# Altium project Template.PrjPCB
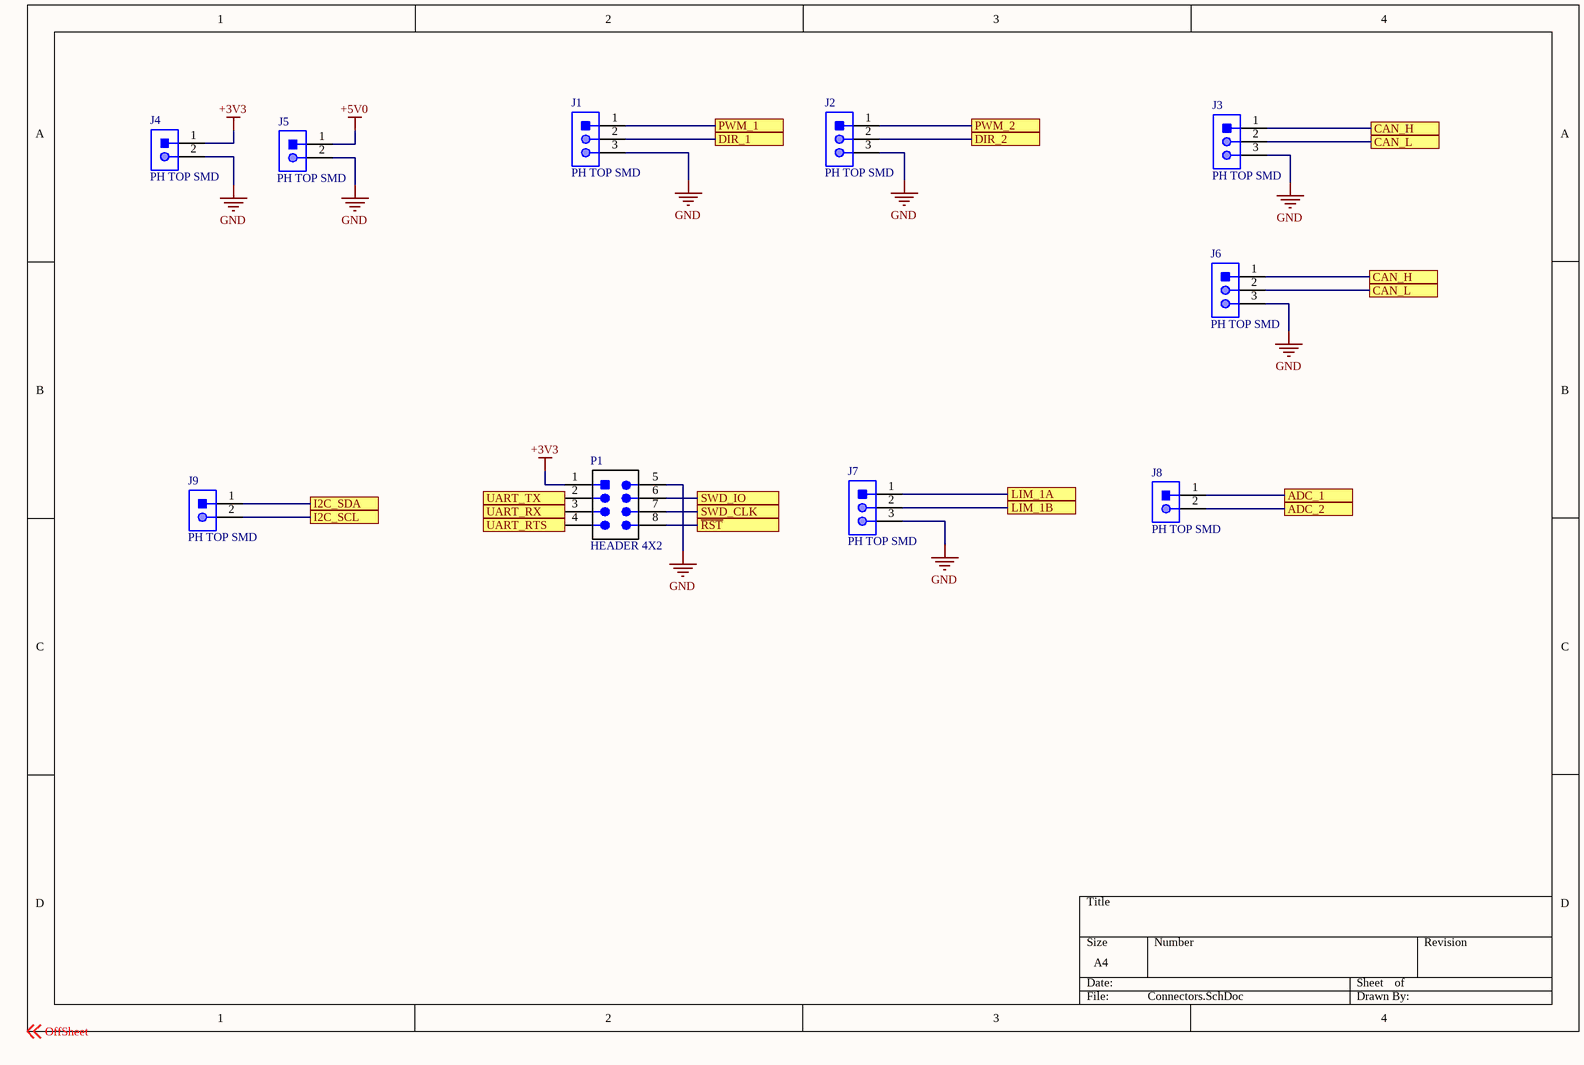
[diagram p0: Connectors.SchDoc]
5 sheets, 61 parts. Net scope: flat (ports and power ports of the same name join across sheets).
Board file: Template.PcbDoc
Sheets:
  Connectors.SchDoc
  Support.SchDoc
  CAN.SchDoc
  MCU.SchDoc
  Power.SchDoc

## Sheet Connectors.SchDoc
size A4

### Parts
J1  PH TOP SMD  [JST-B3B-SM4-TB]
J2  PH TOP SMD  [JST-B3B-SM4-TB]
J3  PH TOP SMD  [JST-B3B-SM4-TB]
J4  PH TOP SMD  [JST-B2B-SM4-TB]
J5  PH TOP SMD  [JST-B2B-SM4-TB]
J6  PH TOP SMD  [JST-B3B-SM4-TB]
J7  PH TOP SMD  [JST-B3B-SM4-TB]
J8  PH TOP SMD  [JST-B2B-SM4-TB]
J9  PH TOP SMD  [JST-B2B-SM4-TB]
P1  HEADER 4X2  [HDR2X4_CEN]

### Ports
ADC_1, ADC_2, CAN_H, CAN_L, DIR_1, DIR_2, I2C_SCL, I2C_SDA, LIM_1A, LIM_1B, PWM_1, PWM_2, SWD_CLK, SWD_IO, UART_RTS, UART_RX, UART_TX, ~{RST}

### Nets
+3V3: J4.1 P1.1(VCC)
+5V0: J5.1
GND: J1.3 J2.3 J3.3 J4.2 J5.2 J6.3 J7.3 P1.5(GND)
Net1_1: J3.2 J6.2 ; port CAN_L
NetC4_2: P1.8 ; port ~{RST}
NetD1_1: J3.1 J6.1 ; port CAN_H
NetJ1_1: J1.1 ; port PWM_1
NetJ1_2: J1.2 ; port DIR_1
NetJ2_1: J2.1 ; port PWM_2
NetJ2_2: J2.2 ; port DIR_2
NetJ7_1: J7.1 ; port LIM_1A
NetJ7_2: J7.2 ; port LIM_1B
NetJ8_1: J8.1 ; port ADC_1
NetJ8_2: J8.2 ; port ADC_2
NetJ9_1: J9.1 ; port I2C_SDA
NetJ9_2: J9.2 ; port I2C_SCL
NetP1_2: P1.2 ; port UART_TX
NetP1_3: P1.3 ; port UART_RX
NetP1_4: P1.4 ; port UART_RTS
NetP1_6: P1.6 ; port SWD_IO
NetP1_7: P1.7 ; port SWD_CLK

### Notes on the sheet
- Labels drawn without touching a wire or pin: OffSheet

### Library data of the parts
J1-J3 J6 J7 = CON_3M_PH_TOP_SMT: CONN HEADER PH TOP 3POS 2MM SMD; Manufacturer: JST; Part Number: B3B-PH-SM4-TB; ComponentLink1Description: Datasheet; ComponentLink1URL: http://www.jst-mfg.com/product/pdf/eng/ePH.pdf
J4 J5 J8 J9 = CON_2M_PH_TOP_SMT: CONN HEADER PH TOP 2POS 2MM SMD; Manufacturer: JST; Part Number: B2B-PH-SM4-TB; ComponentLink1Description: Datasheet; ComponentLink1URL: http://www.jst-mfg.com/product/pdf/eng/ePH.pdf
P1 = HEADER 4X2: Header, 4-Pin Dual row; LatestRevisionDate: 17-Jul-2002; LatestRevisionNote: Re-released for DXP Platform.; Publisher: Altium Limited

## Sheet Support.SchDoc
size A4
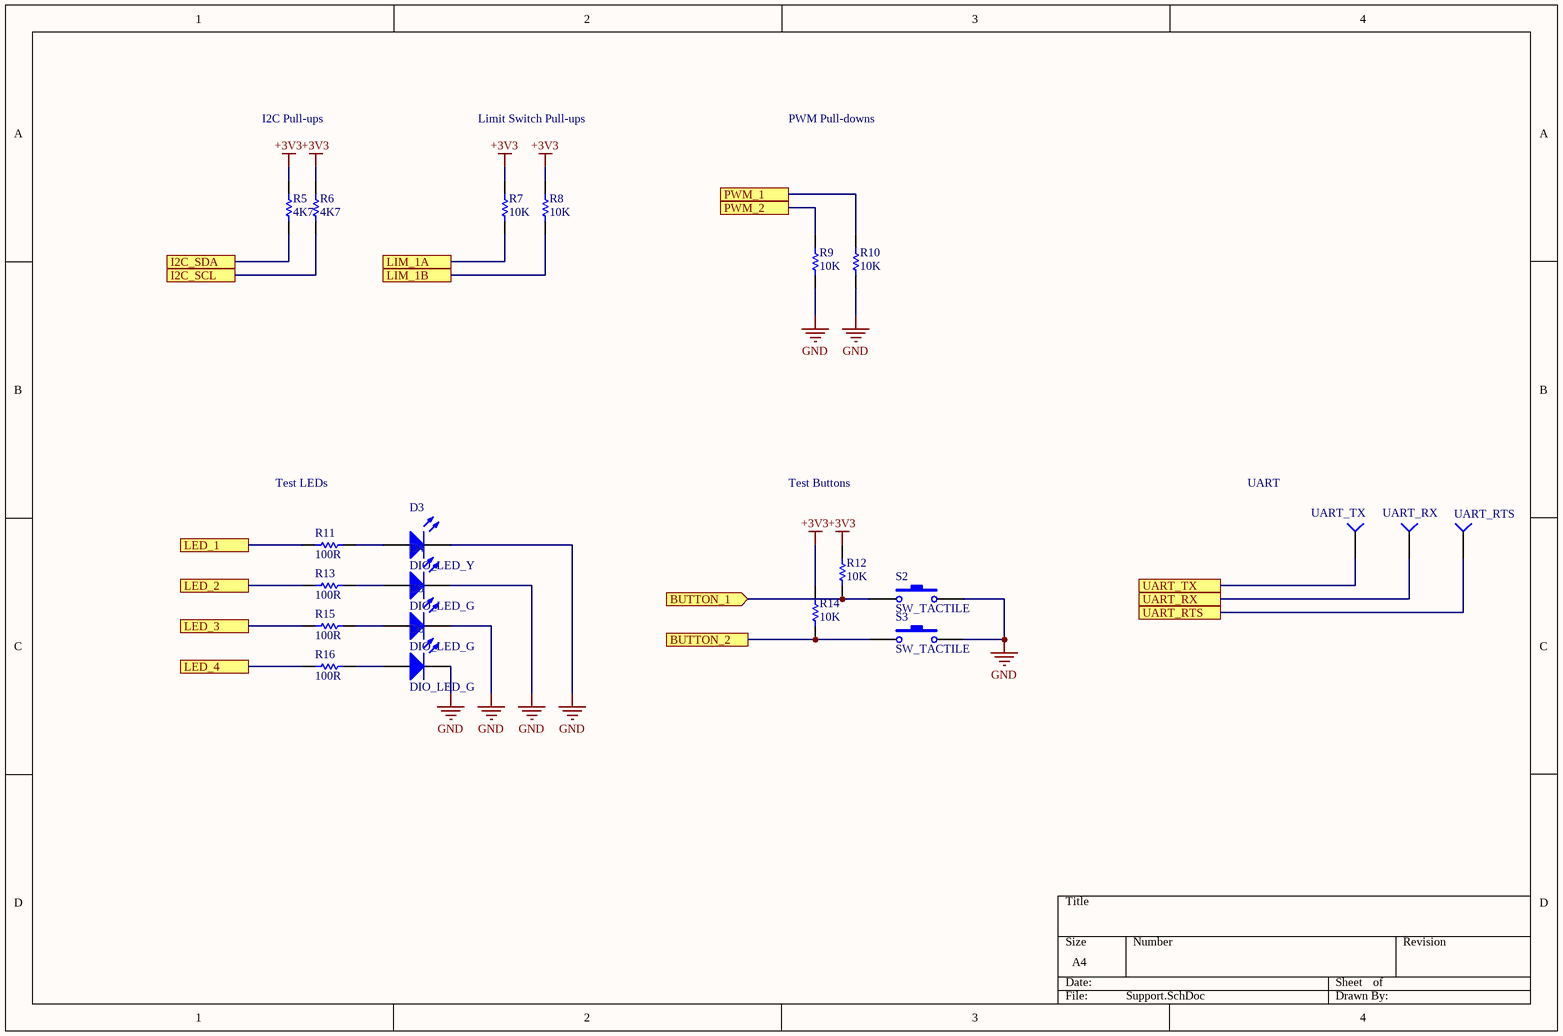
[diagram p1: Support.SchDoc]

### Parts
D3  DIO_LED_Y  [LED_0805]
D4  DIO_LED_G  [LED_0805]
D5  DIO_LED_G  [LED_0805]
D6  DIO_LED_G  [LED_0805]
R5  value 4K7  [RESC0603(1608)_N]  (hidden comment: RES_4K7_0603)
R6  value 4K7  [RESC0603(1608)_N]  (hidden comment: RES_4K7_0603)
R7  value 10K  [RESC0603(1608)_N]  (hidden comment: RES_10K_0603)
R8  value 10K  [RESC0603(1608)_N]  (hidden comment: RES_10K_0603)
R9  value 10K  [RESC0603(1608)_N]  (hidden comment: RES_10K_0603)
R10  value 10K  [RESC0603(1608)_N]  (hidden comment: RES_10K_0603)
R11  value 100R  [RESC0603(1608)_N]  (hidden comment: RES_100R_0603)
R12  value 10K  [RESC0603(1608)_N]  (hidden comment: RES_10K_0603)
R13  value 100R  [RESC0603(1608)_N]  (hidden comment: RES_100R_0603)
R14  value 10K  [RESC0603(1608)_N]  (hidden comment: RES_10K_0603)
R15  value 100R  [RESC0603(1608)_N]  (hidden comment: RES_100R_0603)
R16  value 100R  [RESC0603(1608)_N]  (hidden comment: RES_100R_0603)
S2  SW_TACTILE  [B3U-1100P]
S3  SW_TACTILE  [B3U-1100P]
UART_RTS  TESTPOINT  (value not drawn)
UART_RX  TESTPOINT  (value not drawn)
UART_TX  TESTPOINT  (value not drawn)

### Ports
BUTTON_1 (in), BUTTON_2, I2C_SCL, I2C_SDA, LED_1, LED_2, LED_3, LED_4, LIM_1A, LIM_1B, PWM_1, PWM_2, UART_RTS, UART_RX, UART_TX

### Nets
+3V3: R5.2 R6.2 R7.2 R8.2 R12.2 R14.1
GND: D3.2(K) D4.2(K) D5.2(K) D6.2(K) R9.1 R10.1 S2.2 S3.2
NetD3_1: D3.1(A) R11.2
NetD4_1: D4.1(A) R13.2
NetD5_1: D5.1(A) R15.2
NetD6_1: D6.1(A) R16.2
NetJ1_1: R10.2 ; port PWM_1
NetJ2_1: R9.2 ; port PWM_2
NetJ7_1: R7.1 ; port LIM_1A
NetJ7_2: R8.1 ; port LIM_1B
NetJ9_1: R5.1 ; port I2C_SDA
NetJ9_2: R6.1 ; port I2C_SCL
NetP1_2: UART_TX.1(=value) ; port UART_TX
NetP1_3: UART_RX.1(=value) ; port UART_RX
NetP1_4: UART_RTS.1(=value) ; port UART_RTS
NetR11_1: R11.1 ; port LED_1
NetR12_1: R12.1 S2.1 ; port BUTTON_1
NetR13_1: R13.1 ; port LED_2
NetR14_2: R14.2 S3.1 ; port BUTTON_2
NetR15_1: R15.1 ; port LED_3
NetR16_1: R16.1 ; port LED_4

### Notes on the sheet
- I2C Pull-ups
- Limit Switch Pull-ups
- PWM Pull-downs
- Test LEDs
- Test Buttons
- UART

### Library data of the parts
D3 = DIO_LED_Y: LED YELLOW DIFFUSED 0805 SMD; Part Number: LY R976-PS-36; Manufacturer: OSRAM; Forward Voltage Drop: 2.2V; Package: 0805 (2012 Metric)
D4-D6 = DIO_LED_G: LED GREEN DIFFUSED 0805 SMD; Part Number: LG R971-KN-1; Manufacturer: OSRAM; Forward Voltage Drop: 2.2V; Package: 0805 (2012 Metric)
R5 R6 = RES_4K7_0603: RES SMD 4.7K OHM 5% 1/10W 0603; Manufacturer: Yageo; Part Number (MPN): RC0603JR-074K7L; Package: 0603 (1608 Metric); Dimensions: 0.063" L x 0.031" W (1.60mm x 0.80mm); Tolerance: 5%
R7-R10 R12 R14 = RES_10K_0603: RES SMD 10K OHM 5% 1/10W 0603; Manufacturer: Yageo; Part Number (MPN): RC0603JR-0710KL; Package: 0603 (1608 Metric); Dimensions: 0.063" L x 0.031" W (1.60mm x 0.80mm); Tolerance: 5%
R11 R13 R15 R16 = RES_100R_0603: RES SMD 100 OHM 1% 1/10W 0603; Manufacturer: Yageo; Part Number (MPN): RC0603FR-07100RL; Package: 0603 (1608 Metric); Dimensions: 0.063" L x 0.031" W (1.60mm x 0.80mm); Tolerance: 1%
S2 S3 = SW_TACTILE: Tactile Switch (Grey); Manufacturer Part Number: B3U-1100P; Digikey Part Number: SW1021TR-ND

## Sheet CAN.SchDoc
size A4
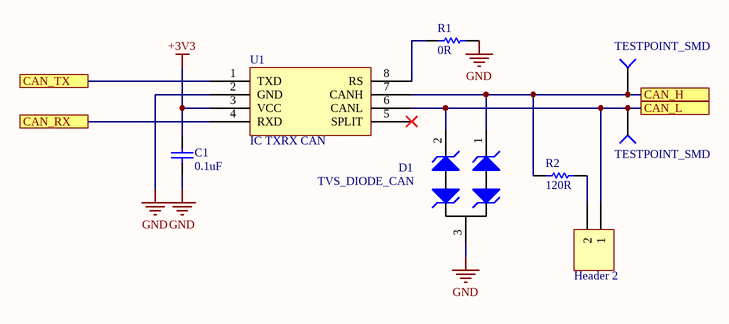
[diagram p2: CAN.SchDoc]

### Parts
1  Header 2  [HDR1X2]
C1  value 0.1uF  [CAPC0603(1608)55_N]  (hidden comment: CAP_0.1uF_16V_0603)
D1  TVS_DIODE_CAN  [TVS_DIODE_CAN]
R1  value 0R  [RESC0603(1608)_N]  (hidden comment: RES_0R_0603)
R2  value 120R  [RESC0603(1608)_N]  (hidden comment: RES_120R_0603)
TP1  TESTPOINT_SMD  [TESTPOINT]
TP2  TESTPOINT_SMD  [TESTPOINT]
U1  IC TXRX CAN  [LTC2875]

### Ports
CAN_H, CAN_L, CAN_RX, CAN_TX

### Nets
+3V3: C1.2 U1.3(VCC)
GND: C1.1 D1.3 R1.2 U1.2(GND)
Net1_1: 1.1 D1.2 TP2.1(=value) U1.6(CANL) ; port CAN_L
Net1_2: 1.2 R2.2
NetD1_1: D1.1 R2.1 TP1.1(=value) U1.7(CANH) ; port CAN_H
NetR1_1: R1.1 U1.8(RS)
NetU1_1: U1.1(TXD) ; port CAN_TX
NetU1_4: U1.4(RXD) ; port CAN_RX

Not connected (* = marked no-connect by the designer): U1 5(SPLIT)*

### Library data of the parts
1 = Header 2: Header, 2-Pin; LatestRevisionDate: 17-Jul-2002; LatestRevisionNote: Re-released for DXP Platform.; Publisher: Altium Limited
C1 = CAP_0.1uF_16V_0603: CAP CER 0.1UF 16V X7R 0603; Part Number: CC0603KRX7R7BB104; Manufacturer: Yageo; Dimensions: 0.063" L x 0.031" W (1.60mm x 0.80mm); Package: 0603 (1608 Metric); Temperature Coefficient: X7R; Voltage Rating: 16V
D1 = TVS_DIODE_CAN: TVS DIODE 24V 41V SOT323-3; Part Number: PESD2CAN,215; Manufacturer: Nexperia USA Inc.; Package: SC-70, SOT-323; ComponentLink1Description: Datasheet; ComponentLink1URL: https://assets.nexperia.com/documents/data-sheet/PESD1CAN-U.pdf
R1 = RES_0R_0603: RES SMD 0 OHM JUMPER 1/10W 0603; Manufacturer: Yageo; Part Number (MPN): RC0603JR-070RL; Package: 0603 (1608 Metric); Dimensions: 0.063" L x 0.031" W (1.60mm x 0.80mm)
R2 = RES_120R_0603: RES SMD 120 OHM 5% 1/10W 0603; Manufacturer: Yageo; Part Number (MPN): RC0603JR-07120RL; Package: 0603 (1608 Metric); Dimensions: 0.063" L x 0.031" W (1.60mm x 0.80mm); Tolerance: 5%
U1 = LTC2875: IC TXRX CAN 4MBPS 8SO; Manufacturer: Linear Technologies; Part Number: LTC2875IS8#PBF; Package: 8-SOIC (0.154", 3.90mm Width); ComponentLink1Description: Datasheet; ComponentLink1URL: https://www.analog.com/media/en/technical-documentation/data-sheets/2875f.pdf

## Sheet MCU.SchDoc
size A4
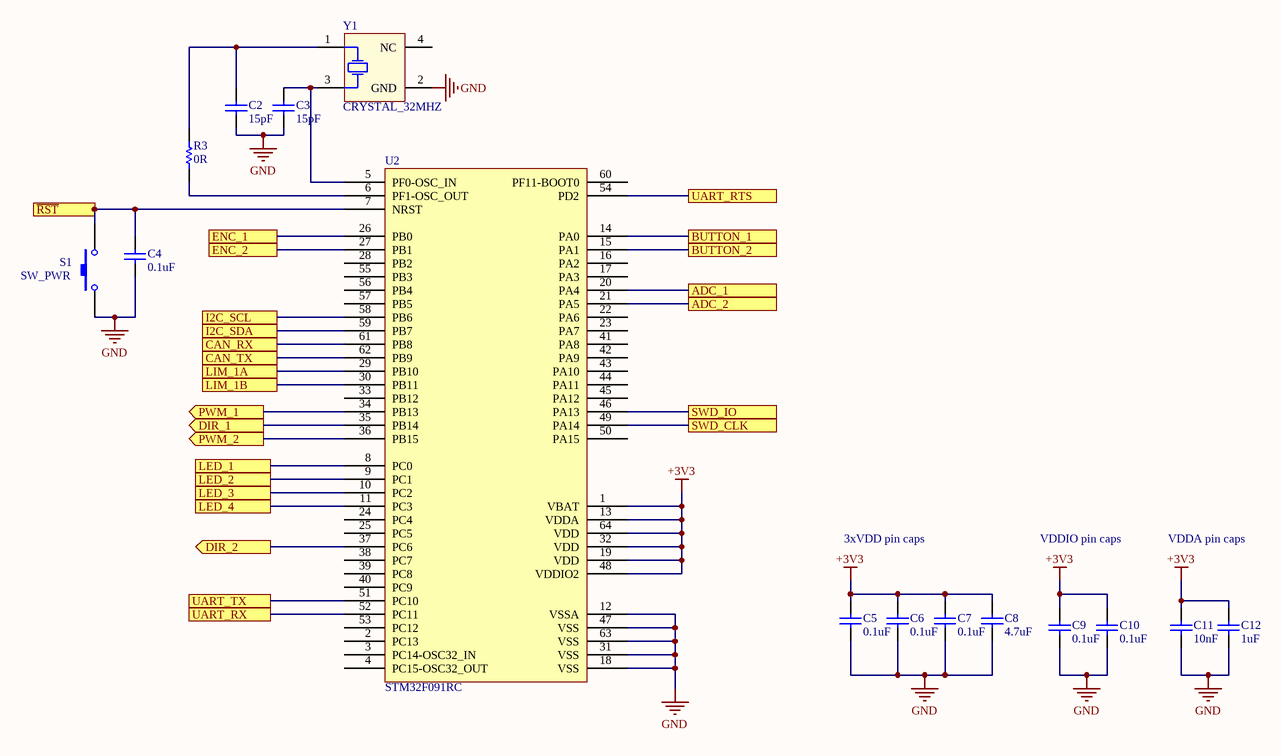
[diagram p3: MCU.SchDoc]

### Parts
C2  value 15pF  [CAPC0603(1608)55_N]  (hidden comment: CAP_15pF_0603)
C3  value 15pF  [CAPC0603(1608)55_N]  (hidden comment: CAP_15pF_0603)
C4  value 0.1uF  [CAPC0603(1608)55_N]  (hidden comment: CAP_0.1uF_16V_0603)
C5  value 0.1uF  [CAPC0603(1608)55_N]  (hidden comment: CAP_0.1uF_16V_0603)
C6  value 0.1uF  [CAPC0603(1608)55_N]  (hidden comment: CAP_0.1uF_16V_0603)
C7  value 0.1uF  [CAPC0603(1608)55_N]  (hidden comment: CAP_0.1uF_16V_0603)
C8  value 4.7uF  [CAPC0603(1608)55_N]  (hidden comment: CAP_4.7uF_0603)
C9  value 0.1uF  [CAPC0603(1608)55_N]  (hidden comment: CAP_0.1uF_16V_0603)
C10  value 0.1uF  [CAPC0603(1608)55_N]  (hidden comment: CAP_0.1uF_16V_0603)
C11  value 10nF  [CAPC0603(1608)55_N]  (hidden comment: CAP_10nF_0603)
C12  value 1uF  [CAPC0603(1608)55_N]  (hidden comment: CAP_1uF_16V_0603)
R3  value 0R  [RESC0603(1608)_N]  (hidden comment: RES_0R_0603)
S1  SW_PWR  [PTS830GM140]
U2  STM32F091RC  [STM_LQFP64_N]
Y1  CRYSTAL_32MHZ  [AVX-CX2520DB32000D0GEJZ1-4_V]

### Ports
ADC_1, ADC_2, BUTTON_1, BUTTON_2, CAN_RX, CAN_TX, DIR_1 (out), DIR_2 (out), ENC_1, ENC_2, I2C_SCL, I2C_SDA, LED_1, LED_2, LED_3, LED_4, LIM_1A, LIM_1B, PWM_1 (out), PWM_2 (out), SWD_CLK, SWD_IO, UART_RTS, UART_RX, UART_TX, ~{RST} (in)

### Nets
+3V3: C5.2 C6.2 C7.2 C8.2 C9.2 C10.2 C11.2 C12.2 U2.1(VBAT) U2.13(VDDA) U2.19(VDD) U2.32(VDD) U2.48(VDDIO2) U2.64(VDD)
GND: C2.1 C3.1 C4.1 C5.1 C6.1 C7.1 C8.1 C9.1 C10.1 C11.1 C12.1 S1.1 U2.12(VSSA) U2.18(VSS) U2.31(VSS) U2.47(VSS) U2.63(VSS) Y1.2(GND)
NetC2_2: C2.2 R3.2 Y1.1(HOT)
NetC3_2: C3.2 U2.5(PF0-OSC_IN) Y1.3(HOT)
NetC4_2: C4.2 S1.2 U2.7(NRST) ; port ~{RST}
NetJ1_1: U2.34(PB13) ; port PWM_1
NetJ1_2: U2.35(PB14) ; port DIR_1
NetJ2_1: U2.36(PB15) ; port PWM_2
NetJ2_2: U2.37(PC6) ; port DIR_2
NetJ7_1: U2.29(PB10) ; port LIM_1A
NetJ7_2: U2.30(PB11) ; port LIM_1B
NetJ8_1: U2.20(PA4) ; port ADC_1
NetJ8_2: U2.21(PA5) ; port ADC_2
NetJ9_1: U2.59(PB7) ; port I2C_SDA
NetJ9_2: U2.58(PB6) ; port I2C_SCL
NetP1_2: U2.51(PC10) ; port UART_TX
NetP1_3: U2.52(PC11) ; port UART_RX
NetP1_4: U2.54(PD2) ; port UART_RTS
NetP1_6: U2.46(PA13) ; port SWD_IO
NetP1_7: U2.49(PA14) ; port SWD_CLK
NetR3_1: R3.1 U2.6(PF1-OSC_OUT)
NetR11_1: U2.8(PC0) ; port LED_1
NetR12_1: U2.14(PA0) ; port BUTTON_1
NetR13_1: U2.9(PC1) ; port LED_2
NetR14_2: U2.15(PA1) ; port BUTTON_2
NetR15_1: U2.10(PC2) ; port LED_3
NetR16_1: U2.11(PC3) ; port LED_4
NetU1_1: U2.62(PB9) ; port CAN_TX
NetU1_4: U2.61(PB8) ; port CAN_RX
NetU2_26: U2.26(PB0) ; port ENC_1
NetU2_27: U2.27(PB1) ; port ENC_2

Not connected (* = marked no-connect by the designer): U2 2(PC13) 3(PC14-OSC32_IN) 4(PC15-OSC32_OUT) 16(PA2) 17(PA3) 22(PA6) 23(PA7) 24(PC4) 25(PC5) 28(PB2) 33(PB12) 38(PC7) 39(PC8) 40(PC9) 41(PA8) 42(PA9) 43(PA10) 44(PA11) 45(PA12) 50(PA15) 53(PC12) 55(PB3) 56(PB4) 57(PB5) 60(PF11-BOOT0); Y1 4(NC)

### Notes on the sheet
- 3xVDD pin caps
- VDDIO pin caps
- VDDA pin caps

### Library data of the parts
C2 C3 = CAP_15pF_0603: CAP CER 15PF 250V NPO 0603; Part Number: AC0603JRNPOYBN150; Manufacturer: Yageo; Temperature Coefficient: NP0; Dimensions: 0.063" L x 0.031" W (1.60mm x 0.80mm); Package: 0603 (1608 Metric); Voltage Rating: 250v
C4-C7 C9 C10 = CAP_0.1uF_16V_0603: as C1 on sheet CAN; Dimensions: 0.063" L x 0.031" W (1.60mm x 0.80mm); Package: 0603 (1608 Metric); Temperature Coefficient: X7R; Voltage Rating: 16V
C8 = CAP_4.7uF_0603: CAP CER 4.7UF 6.3V X5R 0603; Part Number: CC0603KRX5R5BB475; Manufacturer: Yageo; Dimensions: 0.063" L x 0.031" W (1.60mm x 0.80mm); Package: 0603 (1608 Metric); Temperature Coefficient: X5R; Voltage Rating: 6.3V
C11 = CAP_10nF_0603: CAP CER 10000PF 16V X7R 0603; Part Number: CC0603KRX7R7BB103; Manufacturer: Yageo; Dimensions: 0.063" L x 0.031" W (1.60mm x 0.80mm); Package: 0603 (1608 Metric); Temperature Coefficient: X7R; Voltage Rating: 16V
C12 = CAP_1uF_16V_0603: CAP CER 1UF 16V Y5V 0603; Part Number: CC0603ZRY5V7BB105; Manufacturer: Yageo; Dimensions: 0.063" L x 0.031" W (1.60mm x 0.80mm); Package: 0603 (1608 Metric); Temperature Coefficient: Y5V; Voltage Rating: 16V
R3 = RES_0R_0603: as R1 on sheet CAN; Package: 0603 (1608 Metric); Dimensions: 0.063" L x 0.031" W (1.60mm x 0.80mm)
S1 = SW_PWR: Power Switch (Red); pin to pad: 2>4; Part Number: PTS830GM140 SMTR LFS; ComponentLink1Description: Datasheet; ComponentLink1URL: https://www.ckswitches.com/media/1478/pts830.pdf
U2 = STM32F091RC: Manufacturer: STMicroelectronics; Part Number: STM32F091RC; Package: 64-LQFP; ComponentLink1Description: Datasheet; ComponentLink1URL: https://www.st.com/content/ccc/resource/technical/document/datasheet/95/3c/2e/5b/21/09/45/a6/DM00115237.pdf/files/DM00115237.pdf/jcr:content/translations/en.DM00115237.pdf#%5B%7B%22num%22%3A96%2C%22gen%22%3A0%7D%2C%7B%22name%22%3A%22XYZ%22%7D%2C67%2C755%2Cnull%5D
Y1 = CRYSTAL_32MHZ: CRYSTAL 32MHZ 8PF SMD; Part Number: CX2520DB32000D0GPSC1; Manufacturer: Kyocera International Inc. Electronic Components; Package: 4-SMD, No Lead; Dimensions: 0.098" L x 0.079" W (2.50mm x 2.00mm)

## Sheet Power.SchDoc
size A4
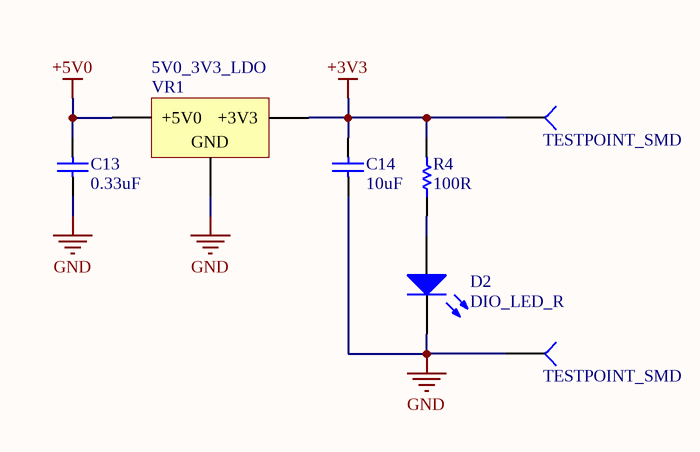
[diagram p4: Power.SchDoc]

### Parts
C13  value 0.33uF  [CAPC0603(1608)55_N]  (hidden comment: CAP_0.33uF_16V_0603)
C14  value 10uF  [CAPC0603(1608)55_N]  (hidden comment: CAP_10uF_0603)
D2  DIO_LED_R  [LED_0805]
R4  value 100R  [RESC0603(1608)_N]  (hidden comment: RES_100R_0603)
TP3  TESTPOINT_SMD  [TESTPOINT]
TP4  TESTPOINT_SMD  [TESTPOINT]
VR1  5V0_3V3_LDO  [VOLTAGE_REGULATOR]

### Nets
+3V3: C14.2 R4.2 TP3.1(=value) VR1.3(+3V3)
+5V0: C13.2 VR1.1(+5V0)
GND: C13.1 C14.1 D2.2(K) TP4.1(=value) VR1.2(GND)
NetD2_1: D2.1(A) R4.1

### Library data of the parts
C13 = CAP_0.33uF_16V_0603: CAP CER 0.33UF 16V X7R 0603; Part Number: GRM188R71C334KA01D; Manufacturer: Murata Electronics North America; Dimensions: 0.063" L x 0.031" W (1.60mm x 0.80mm); Package: 0603 (1608 Metric); Temperature Coefficient: X7R; Voltage Rating: 16V
C14 = CAP_10uF_0603: CAP CER 10UF 10V X5R 0603; Part Number: CC0603MRX5R6BB106; Manufacturer: Yageo; Dimensions: 0.063" L x 0.031" W (1.60mm x 0.80mm); Package: 0603 (1608 Metric); Temperature Coefficient: X5R; Voltage Rating: 10V
D2 = DIO_LED_R: LED RED DIFFUSED 0805 SMD; Part Number: LS R976-NR-1; Manufacturer: OSRAM; Forward Voltage Drop: 2V; Package: 0805 (2012 Metric)
R4 = RES_100R_0603: as R11 on sheet Support; Package: 0603 (1608 Metric); Dimensions: 0.063" L x 0.031" W (1.60mm x 0.80mm); Tolerance: 1%
VR1 = 5V0_3V3_LDO: IC REG LINEAR 3.3V 1A DPAK; Part Number: NCP1117DT33T5G; Manufacturer: ON Semiconductor; Current Output: 1A

## Nets that join several sheets
+3V3: Connectors (J4.1 P1.1), Support (6 pins), CAN (C1.2 U1.3), MCU (14 pins), Power (C14.2 R4.2 TP3.1 VR1.3)
+5V0: Connectors (J5.1), Power (C13.2 VR1.1)
GND: Connectors (8 pins), Support (8 pins), CAN (C1.1 D1.3 R1.2 U1.2), MCU (18 pins), Power (5 pins)
Net1_1: Connectors (J3.2 J6.2), CAN (1.1 D1.2 TP2.1 U1.6)
NetC4_2: Connectors (P1.8), MCU (C4.2 S1.2 U2.7)
NetD1_1: Connectors (J3.1 J6.1), CAN (D1.1 R2.1 TP1.1 U1.7)
NetJ1_1: Connectors (J1.1), Support (R10.2), MCU (U2.34)
NetJ1_2: Connectors (J1.2), MCU (U2.35)
NetJ2_1: Connectors (J2.1), Support (R9.2), MCU (U2.36)
NetJ2_2: Connectors (J2.2), MCU (U2.37)
NetJ7_1: Connectors (J7.1), Support (R7.1), MCU (U2.29)
NetJ7_2: Connectors (J7.2), Support (R8.1), MCU (U2.30)
NetJ8_1: Connectors (J8.1), MCU (U2.20)
NetJ8_2: Connectors (J8.2), MCU (U2.21)
NetJ9_1: Connectors (J9.1), Support (R5.1), MCU (U2.59)
NetJ9_2: Connectors (J9.2), Support (R6.1), MCU (U2.58)
NetP1_2: Connectors (P1.2), Support (UART_TX.1), MCU (U2.51)
NetP1_3: Connectors (P1.3), Support (UART_RX.1), MCU (U2.52)
NetP1_4: Connectors (P1.4), Support (UART_RTS.1), MCU (U2.54)
NetP1_6: Connectors (P1.6), MCU (U2.46)
NetP1_7: Connectors (P1.7), MCU (U2.49)
NetR11_1: Support (R11.1), MCU (U2.8)
NetR12_1: Support (R12.1 S2.1), MCU (U2.14)
NetR13_1: Support (R13.1), MCU (U2.9)
NetR14_2: Support (R14.2 S3.1), MCU (U2.15)
NetR15_1: Support (R15.1), MCU (U2.10)
NetR16_1: Support (R16.1), MCU (U2.11)
NetU1_1: CAN (U1.1), MCU (U2.62)
NetU1_4: CAN (U1.4), MCU (U2.61)